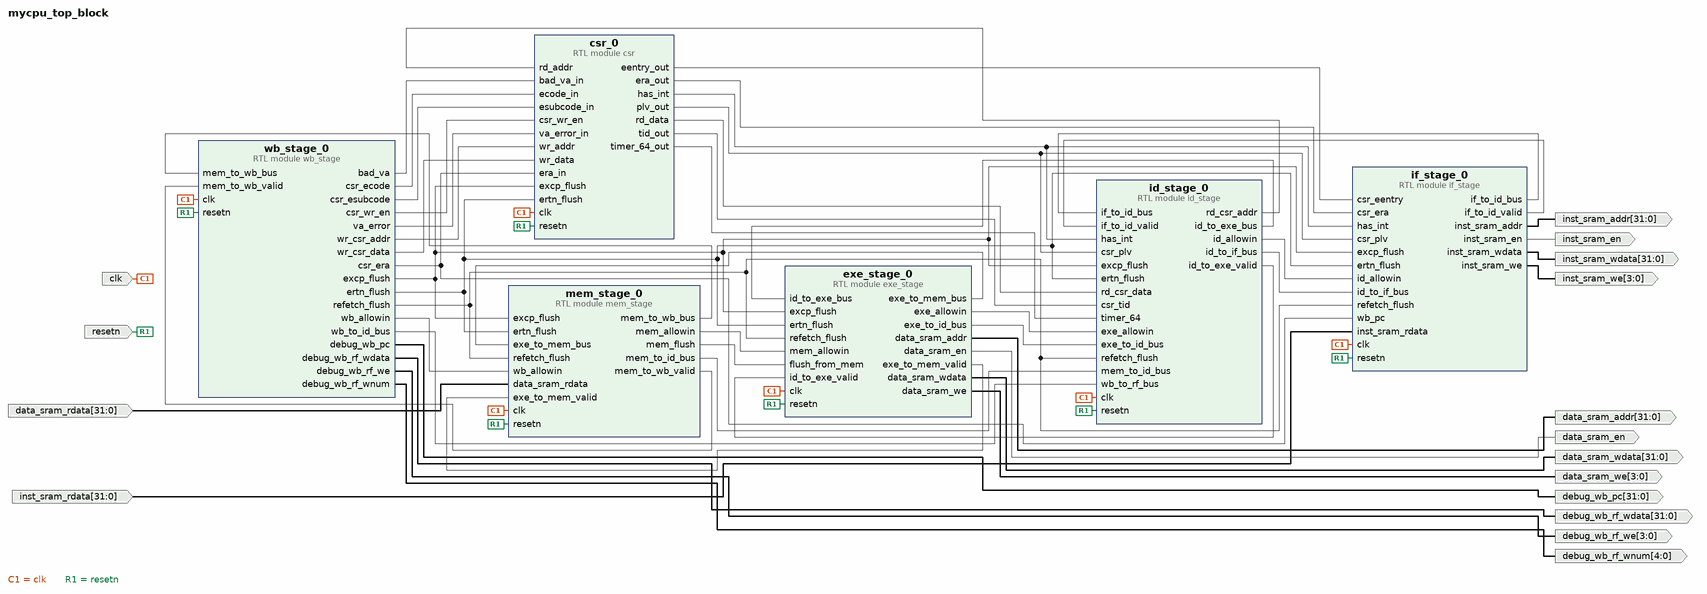
[diagram p0: block diagram of the top level]
# Vivado block design mycpu_top_block, xc7a200tfbg676-1, Vivado 2023.2
create_bd_design mycpu_top_block

create_bd_port -dir I -from 31 -to 0 data_sram_rdata
create_bd_port -dir O -from 31 -to 0 inst_sram_addr
create_bd_port -dir O -from 31 -to 0 inst_sram_wdata
create_bd_port -dir I -from 31 -to 0 inst_sram_rdata
create_bd_port -dir O data_sram_en
create_bd_port -dir O -from 31 -to 0 data_sram_addr
create_bd_port -dir O -from 31 -to 0 data_sram_wdata
create_bd_port -dir O -from 31 -to 0 debug_wb_pc
create_bd_port -dir O -from 3 -to 0 debug_wb_rf_we
create_bd_port -dir O -from 4 -to 0 debug_wb_rf_wnum
create_bd_port -dir O -from 31 -to 0 debug_wb_rf_wdata
create_bd_port -dir O inst_sram_en
create_bd_port -dir O -from 3 -to 0 inst_sram_we
create_bd_port -dir O -from 3 -to 0 data_sram_we
create_bd_port -dir I clk
create_bd_port -dir I resetn

create_bd_cell -type module -reference if_stage if_stage_0
create_bd_cell -type module -reference id_stage id_stage_0
create_bd_cell -type module -reference exe_stage exe_stage_0
create_bd_cell -type module -reference mem_stage mem_stage_0
create_bd_cell -type module -reference wb_stage wb_stage_0
create_bd_cell -type module -reference csr csr_0

# ---- connections ----

connect_bd_net [get_bd_pins wb_stage_0/excp_flush] \
  [get_bd_pins mem_stage_0/excp_flush] [get_bd_pins exe_stage_0/excp_flush] [get_bd_pins id_stage_0/excp_flush] \
  [get_bd_pins if_stage_0/excp_flush] [get_bd_pins csr_0/excp_flush]
connect_bd_net [get_bd_pins wb_stage_0/ertn_flush] \
  [get_bd_pins mem_stage_0/ertn_flush] [get_bd_pins exe_stage_0/ertn_flush] [get_bd_pins id_stage_0/ertn_flush] \
  [get_bd_pins if_stage_0/ertn_flush] [get_bd_pins csr_0/ertn_flush]
connect_bd_net [get_bd_ports clk] \
  [get_bd_pins mem_stage_0/clk] [get_bd_pins exe_stage_0/clk] [get_bd_pins id_stage_0/clk] [get_bd_pins if_stage_0/clk] \
  [get_bd_pins wb_stage_0/clk] [get_bd_pins csr_0/clk]
connect_bd_net [get_bd_pins csr_0/eentry_out] [get_bd_pins if_stage_0/csr_eentry]
connect_bd_net [get_bd_pins csr_0/era_out] [get_bd_pins if_stage_0/csr_era]
connect_bd_net [get_bd_pins csr_0/has_int] [get_bd_pins id_stage_0/has_int] [get_bd_pins if_stage_0/has_int]
connect_bd_net [get_bd_pins csr_0/plv_out] [get_bd_pins id_stage_0/csr_plv] [get_bd_pins if_stage_0/csr_plv]
connect_bd_net [get_bd_pins csr_0/rd_data] [get_bd_pins id_stage_0/rd_csr_data]
connect_bd_net [get_bd_pins csr_0/tid_out] [get_bd_pins id_stage_0/csr_tid]
connect_bd_net [get_bd_pins csr_0/timer_64_out] [get_bd_pins id_stage_0/timer_64]
connect_bd_net [get_bd_ports data_sram_rdata] [get_bd_pins mem_stage_0/data_sram_rdata]
connect_bd_net [get_bd_pins exe_stage_0/data_sram_addr] [get_bd_ports data_sram_addr]
connect_bd_net [get_bd_pins exe_stage_0/data_sram_en] [get_bd_ports data_sram_en]
connect_bd_net [get_bd_pins exe_stage_0/data_sram_wdata] [get_bd_ports data_sram_wdata]
connect_bd_net [get_bd_pins exe_stage_0/data_sram_we] [get_bd_ports data_sram_we]
connect_bd_net [get_bd_pins exe_stage_0/exe_allowin] [get_bd_pins id_stage_0/exe_allowin]
connect_bd_net [get_bd_pins exe_stage_0/exe_to_id_bus] [get_bd_pins id_stage_0/exe_to_id_bus]
connect_bd_net [get_bd_pins exe_stage_0/exe_to_mem_bus] [get_bd_pins mem_stage_0/exe_to_mem_bus]
connect_bd_net [get_bd_pins exe_stage_0/exe_to_mem_valid] [get_bd_pins mem_stage_0/exe_to_mem_valid]
connect_bd_net [get_bd_pins id_stage_0/id_allowin] [get_bd_pins if_stage_0/id_allowin]
connect_bd_net [get_bd_pins id_stage_0/id_to_exe_bus] [get_bd_pins exe_stage_0/id_to_exe_bus]
connect_bd_net [get_bd_pins id_stage_0/id_to_exe_valid] [get_bd_pins exe_stage_0/id_to_exe_valid]
connect_bd_net [get_bd_pins id_stage_0/id_to_if_bus] [get_bd_pins if_stage_0/id_to_if_bus]
connect_bd_net [get_bd_pins id_stage_0/rd_csr_addr] [get_bd_pins csr_0/rd_addr]
connect_bd_net [get_bd_pins if_stage_0/if_to_id_bus] [get_bd_pins id_stage_0/if_to_id_bus]
connect_bd_net [get_bd_pins if_stage_0/if_to_id_valid] [get_bd_pins id_stage_0/if_to_id_valid]
connect_bd_net [get_bd_pins if_stage_0/inst_sram_addr] [get_bd_ports inst_sram_addr]
connect_bd_net [get_bd_pins if_stage_0/inst_sram_en] [get_bd_ports inst_sram_en]
connect_bd_net [get_bd_pins if_stage_0/inst_sram_wdata] [get_bd_ports inst_sram_wdata]
connect_bd_net [get_bd_pins if_stage_0/inst_sram_we] [get_bd_ports inst_sram_we]
connect_bd_net [get_bd_ports inst_sram_rdata] [get_bd_pins if_stage_0/inst_sram_rdata]
connect_bd_net [get_bd_pins mem_stage_0/mem_allowin] [get_bd_pins exe_stage_0/mem_allowin]
connect_bd_net [get_bd_pins mem_stage_0/mem_flush] [get_bd_pins exe_stage_0/flush_from_mem]
connect_bd_net [get_bd_pins mem_stage_0/mem_to_id_bus] [get_bd_pins id_stage_0/mem_to_id_bus]
connect_bd_net [get_bd_pins mem_stage_0/mem_to_wb_bus] [get_bd_pins wb_stage_0/mem_to_wb_bus]
connect_bd_net [get_bd_pins mem_stage_0/mem_to_wb_valid] [get_bd_pins wb_stage_0/mem_to_wb_valid]
connect_bd_net [get_bd_ports resetn] \
  [get_bd_pins mem_stage_0/resetn] [get_bd_pins exe_stage_0/resetn] [get_bd_pins id_stage_0/resetn] \
  [get_bd_pins if_stage_0/resetn] [get_bd_pins wb_stage_0/resetn] [get_bd_pins csr_0/resetn]
connect_bd_net [get_bd_pins wb_stage_0/bad_va] [get_bd_pins csr_0/bad_va_in]
connect_bd_net [get_bd_pins wb_stage_0/csr_ecode] [get_bd_pins csr_0/ecode_in]
connect_bd_net [get_bd_pins wb_stage_0/csr_era] [get_bd_pins if_stage_0/wb_pc] [get_bd_pins csr_0/era_in]
connect_bd_net [get_bd_pins wb_stage_0/csr_esubcode] [get_bd_pins csr_0/esubcode_in]
connect_bd_net [get_bd_pins wb_stage_0/csr_wr_en] [get_bd_pins csr_0/csr_wr_en]
connect_bd_net [get_bd_pins wb_stage_0/debug_wb_pc] [get_bd_ports debug_wb_pc]
connect_bd_net [get_bd_pins wb_stage_0/debug_wb_rf_wdata] [get_bd_ports debug_wb_rf_wdata]
connect_bd_net [get_bd_pins wb_stage_0/debug_wb_rf_we] [get_bd_ports debug_wb_rf_we]
connect_bd_net [get_bd_pins wb_stage_0/debug_wb_rf_wnum] [get_bd_ports debug_wb_rf_wnum]
connect_bd_net [get_bd_pins wb_stage_0/refetch_flush] \
  [get_bd_pins mem_stage_0/refetch_flush] [get_bd_pins exe_stage_0/refetch_flush] [get_bd_pins id_stage_0/refetch_flush] \
  [get_bd_pins if_stage_0/refetch_flush]
connect_bd_net [get_bd_pins wb_stage_0/va_error] [get_bd_pins csr_0/va_error_in]
connect_bd_net [get_bd_pins wb_stage_0/wb_allowin] [get_bd_pins mem_stage_0/wb_allowin]
connect_bd_net [get_bd_pins wb_stage_0/wb_to_id_bus] [get_bd_pins id_stage_0/wb_to_rf_bus]
connect_bd_net [get_bd_pins wb_stage_0/wr_csr_addr] [get_bd_pins csr_0/wr_addr]
connect_bd_net [get_bd_pins wb_stage_0/wr_csr_data] [get_bd_pins csr_0/wr_data]

validate_bd_design
save_bd_design
